# Altium schematic sheet COVER PAGE.SchDoc: USB_HUB 3.0
size A3; DrawnBy: Luca Schenetti; Engineer: Luca Schenetti; Revision: A; SheetNumber: 1; SheetTotal: 11; Material: JLC06161H-3313
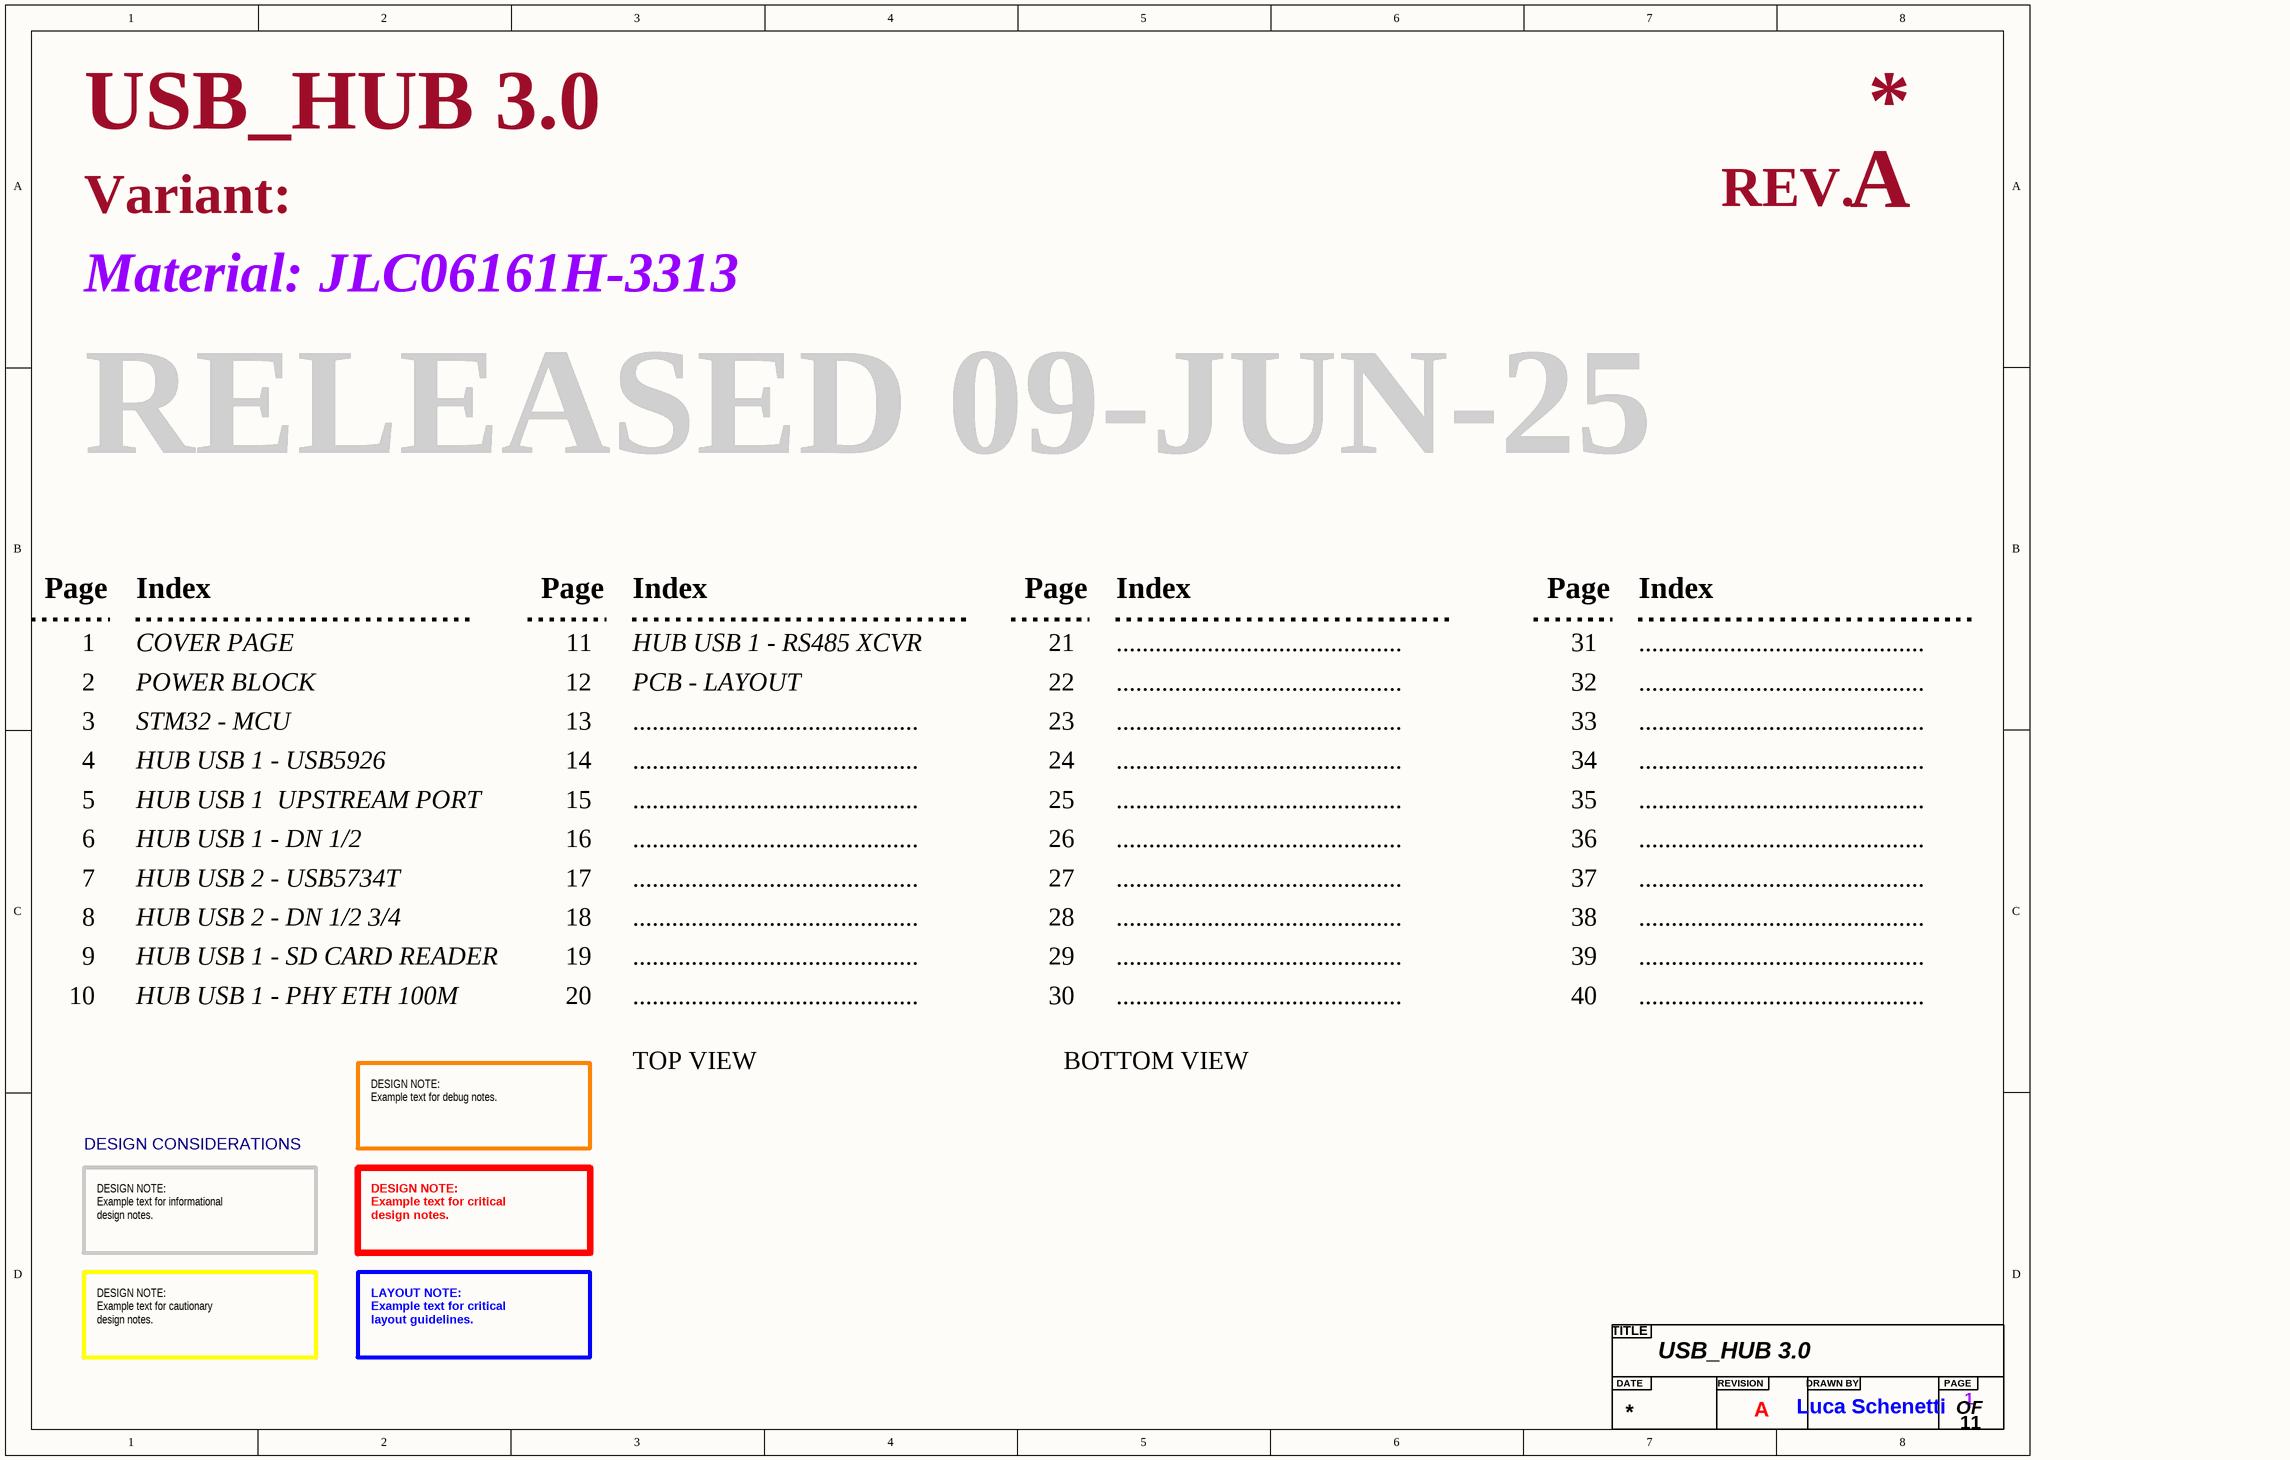
[diagram p0: COVER PAGE.SchDoc]

## Parts
?  Title  (value not drawn)  (graphical)

## Notes on the sheet
- Variant:
- REV.
- Material:
- RELEASED 09-JUN-25
- Page
- Index
- 1
- 2
- COVER PAGE
- POWER BLOCK
- 11
- 12
- PCB - LAYOUT
- HUB USB 1 - RS485 XCVR
- 21
- 22
- ............................................
- 31
- 32
- 3
- STM32 - MCU
- 13
- 23
- 33
- 4
- 5
- HUB USB 1 - USB5926
- HUB USB 1  UPSTREAM PORT
- 14
- 15
- 24
- 25
- 34
- 35
- 6
- 7
- HUB USB 2 - USB5734T
- HUB USB 1 - DN 1/2
- 16
- 17
- 26
- 27
- 36
- 37
- 8
- HUB USB 2 - DN 1/2 3/4
- 18
- 28
- 38
- 9
- 10
- HUB USB 1 - SD CARD READER
- HUB USB 1 - PHY ETH 100M
- 19
- 20
- 29
- 30
- 39
- 40
- TOP VIEW
- BOTTOM VIEW
- DESIGN CONSIDERATIONS
- DESIGN NOTE:
  Example text for debug notes.
- DESIGN NOTE:
  Example text for informational
  design notes.
- DESIGN NOTE:
  Example text for critical
  design notes.
- DESIGN NOTE:
  Example text for cautionary
  design notes.
- LAYOUT NOTE:
  Example text for critical
  layout guidelines.
- (in symbol Title) TITLE; DATE; REVISION; DRAWN BY; PAGE; OF